# EAGLE design Model5 (EAGLE 6.5.0)
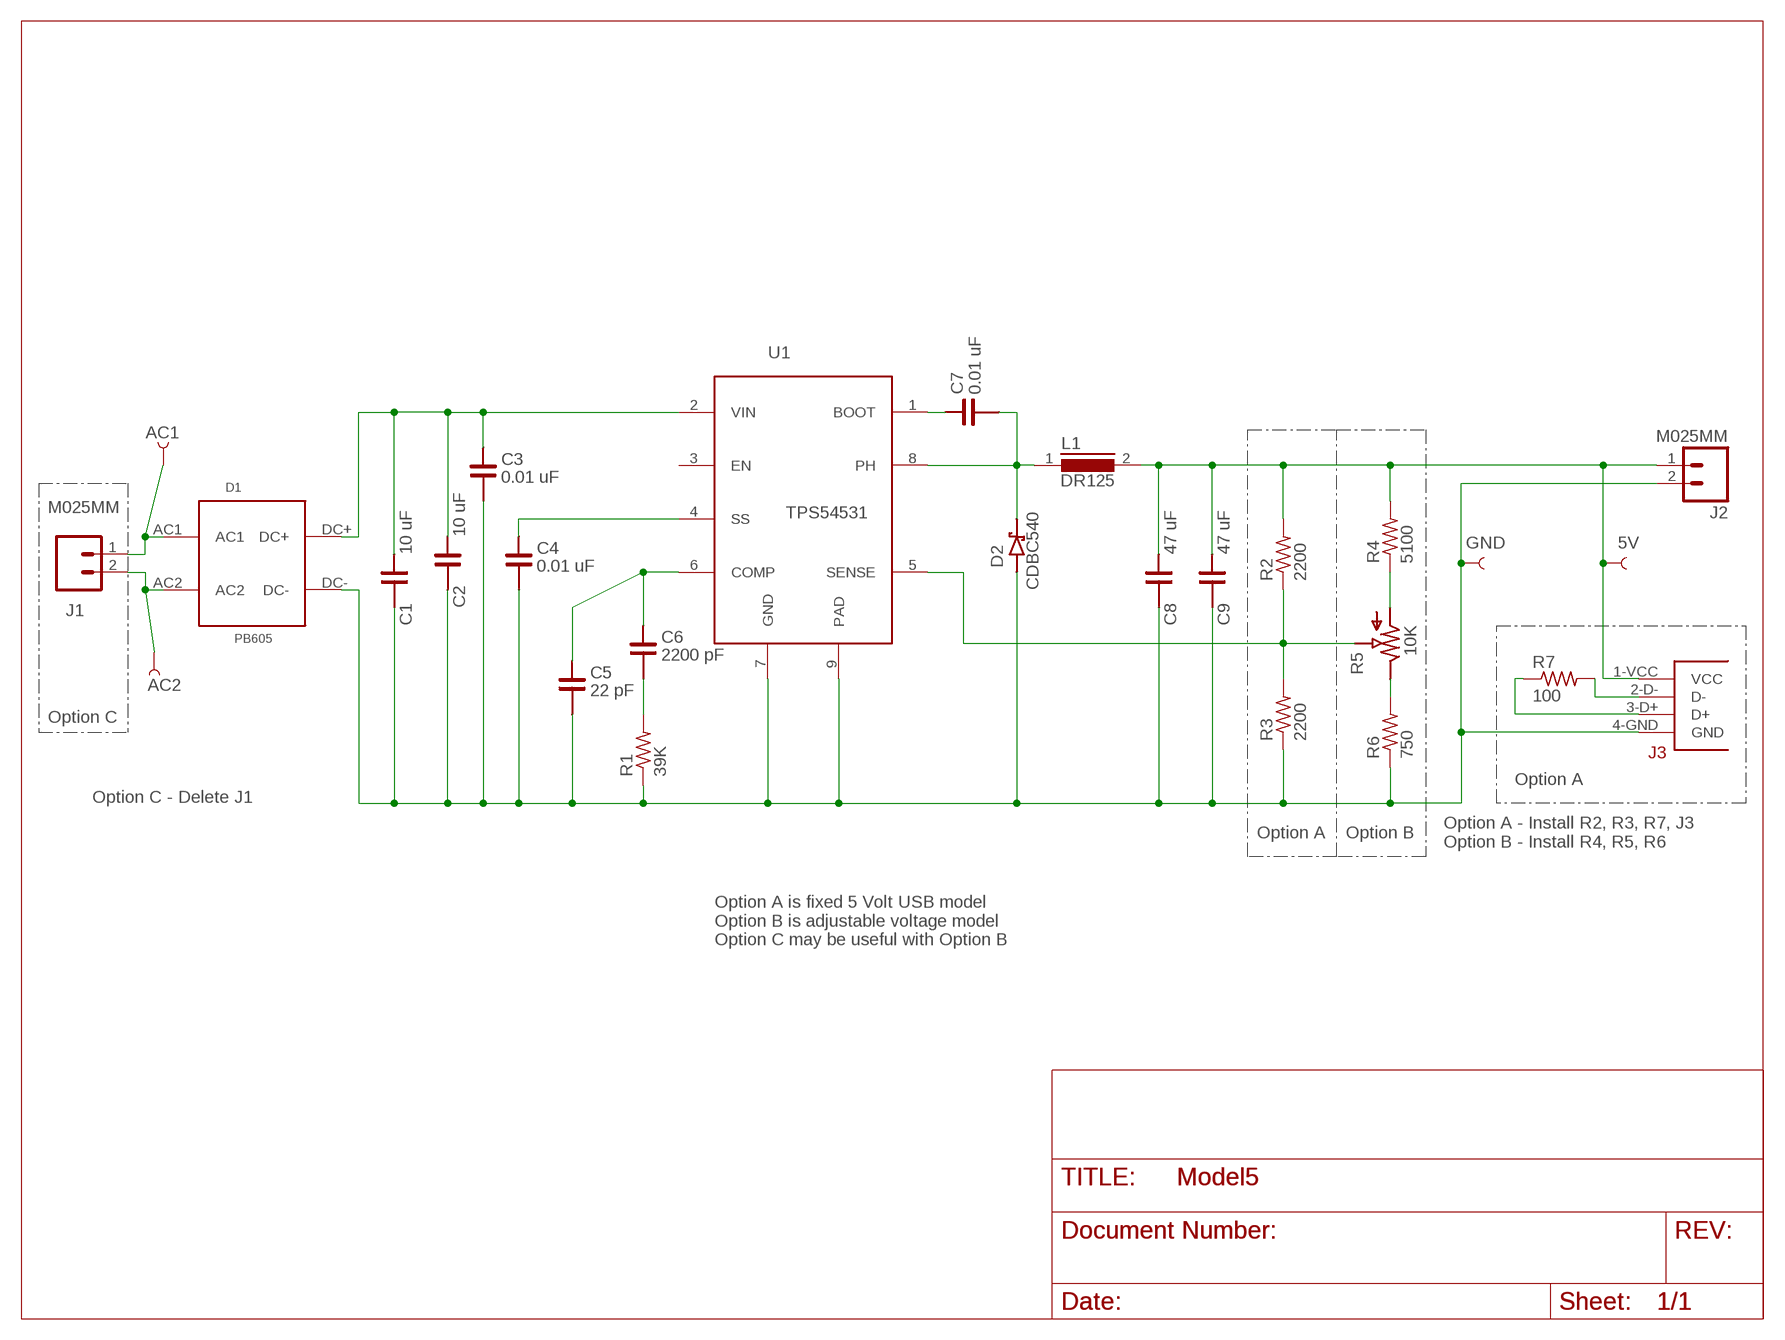
[diagram p0: schematic, sheet 1]

## Parts
5V  TEST-POINT3  [PAD.03X.03]
AC1  TEST-POINT3  [PAD.03X.03]
AC2  TEST-POINT3  [PAD.03X.03]
C1  10 uF  CN-1210  [1210]
C2  10 uF  CN-1210  [1210]
C3  0.01 uF  CN-0805  [0805]
C4  0.01 uF  CN-0805  [0805]
C5  22 pF  CN-0805  [0805]
C6  2200 pF  CN-0805  [0805]
C7  0.01 uF  CN-0805  [0805]
C8  47 uF  CN-1206  [C1206]
C9  47 uF  CN-1206  [C1206]
D1  PB605  [QUAD4PIN]
D2  CDBC540  [DO214AB]
GND  TEST-POINT3  [PAD.03X.03]
J1  M025MM  [SCREWTERMINAL-5MM-2]
J2  M025MM  [SCREWTERMINAL-5MM-2]
JP3  87520-USB-A-FEMALE  [87520-USB-A-FEMALE]
L1  DR125  [DR125]
R1  39K  R-US_R0805  [R0805]
R2  2200  R-US_R0805  [R0805]
R3  2200  R-US_R0805  [R0805]
R4  5100  R-US_R0805  [R0805]
R5  3214J  [3214J]
R6  750  R-US_R0805  [R0805]
R7  100  R-US_R0805  [R0805]
U1  TPS54531  [SOIC127P600X170-9N]

## Nets
5V [power]: 5V.P$1 C8.1 C9.1 J2.1 JP3.1-VCC(VCC) L1.2 R2.2 R4.2
AC1 [power]: AC1.P$1 D1.AC1 J1.1
AC2 [power]: AC2.P$1 D1.AC2 J1.2
BOOT: C7.1 U1.1(BOOT)
COMP: C5.1 C6.1 U1.6(COMP)
D+: JP3.3-D+(D+) R7.1
D-: JP3.2-D-(D-) R7.2
GND [power]: C1.2 C2.2 C3.2 C4.2 C5.2 C8.2 C9.2 D1.DC- D2.ANODE GND.P$1 J2.2 JP3.4-GND(GND) R1.1 R3.1 R6.1 U1.7(GND) U1.9(PAD)
N$1: C6.2 R1.2
N$2: R4.1 R5.P$1
N$7: R5.P$3 R6.2
SENSE: R2.1 R3.2 R5.P$2 U1.5(SENSE)
SLOW: C4.1 U1.4(SS)
VIN [power]: C1.1 C2.1 C3.1 D1.DC+ U1.2(VIN)
VSW [power]: C7.2 D2.CATHODE L1.1 U1.8(PH)
Unconnected: U1.3(EN)

## Notes on the sheet
- Option C
- Option A
- Option C - Delete J1
- Option A | Option B
- Option A - Install R2, R3, R7, J3
  Option B - Install R4, R5, R6
- Option A is fixed 5 Volt USB model
  Option B is adjustable voltage model
  Option C may be useful with Option B

## Library data of the parts
5V AC1 AC2 GND = SparkFun-Passives:TEST-POINT: Bare copper test points for troubleshooting or ICT
C1 C2 = passives:CN-1210
C3-C7 = passives:CN-0805
C8 C9 = passives:CN-1206
D1 = semi:PB605
D2 = semi:CDBC540
J1 J2 = SparkFun-Connectors:M02: Standard 2-pin 0.1" header. Use with - straight break away headers ( PRT-00116) - right angle break away headers (PRT-00553) - swiss pins (PRT-00743) - machine pins (PRT-00117) - female headers (PRT-00115) Molex polarized connector foot print use with: PRT-08233 with associated crimp pins and housings. 2.54_SCREWTERM for use with PRT-10571. 3.5mm Screw Terminal footprints for PRT-08084 5mm Screw Terminal footprints for use with PRT-08433
JP3 = mech:87520-USB-A-FEMALE
L1 = inductors:DR125: High Power Density, High Efficiency, Shielded Inductors Source: coiltronics_dr_series.pdf
R1-R4 R6 R7 = resistor:R-US_: RESISTOR, American symbol
R5 = mech:3214J
U1 = semi:TPS54531

## Net classes
1 ground: width 0.813 mm, drill 0.61 mm, clearance 0.305 mm
2 power: width 0.813 mm, drill 0.61 mm, clearance 0.305 mm

## Board
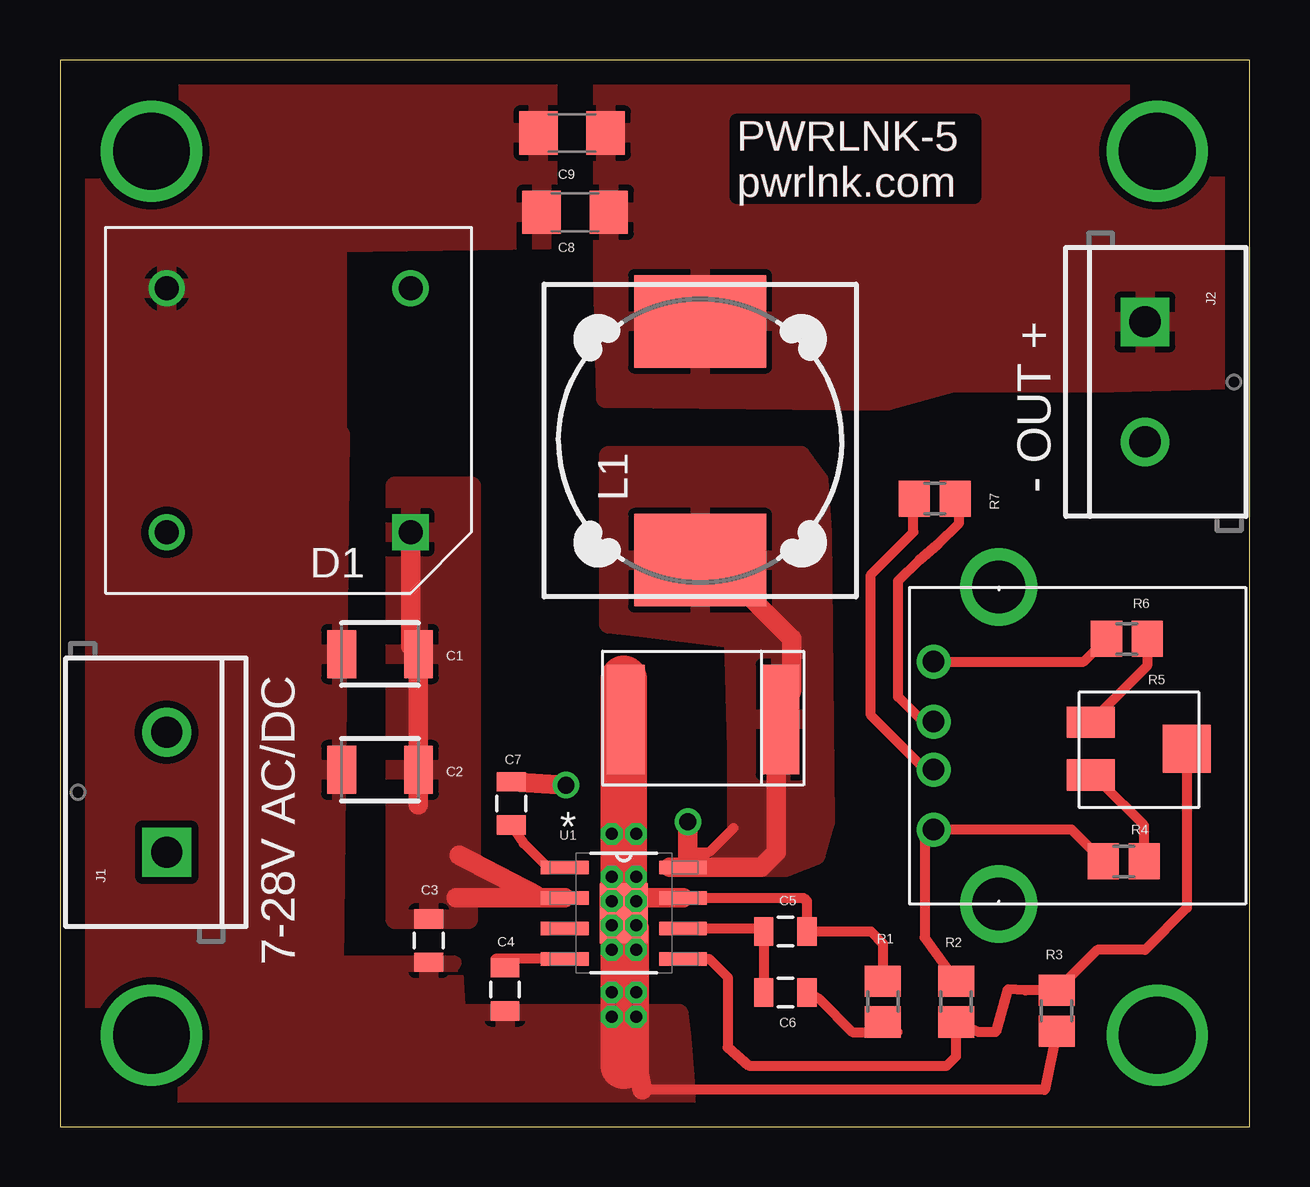
[diagram p1: board, top side]
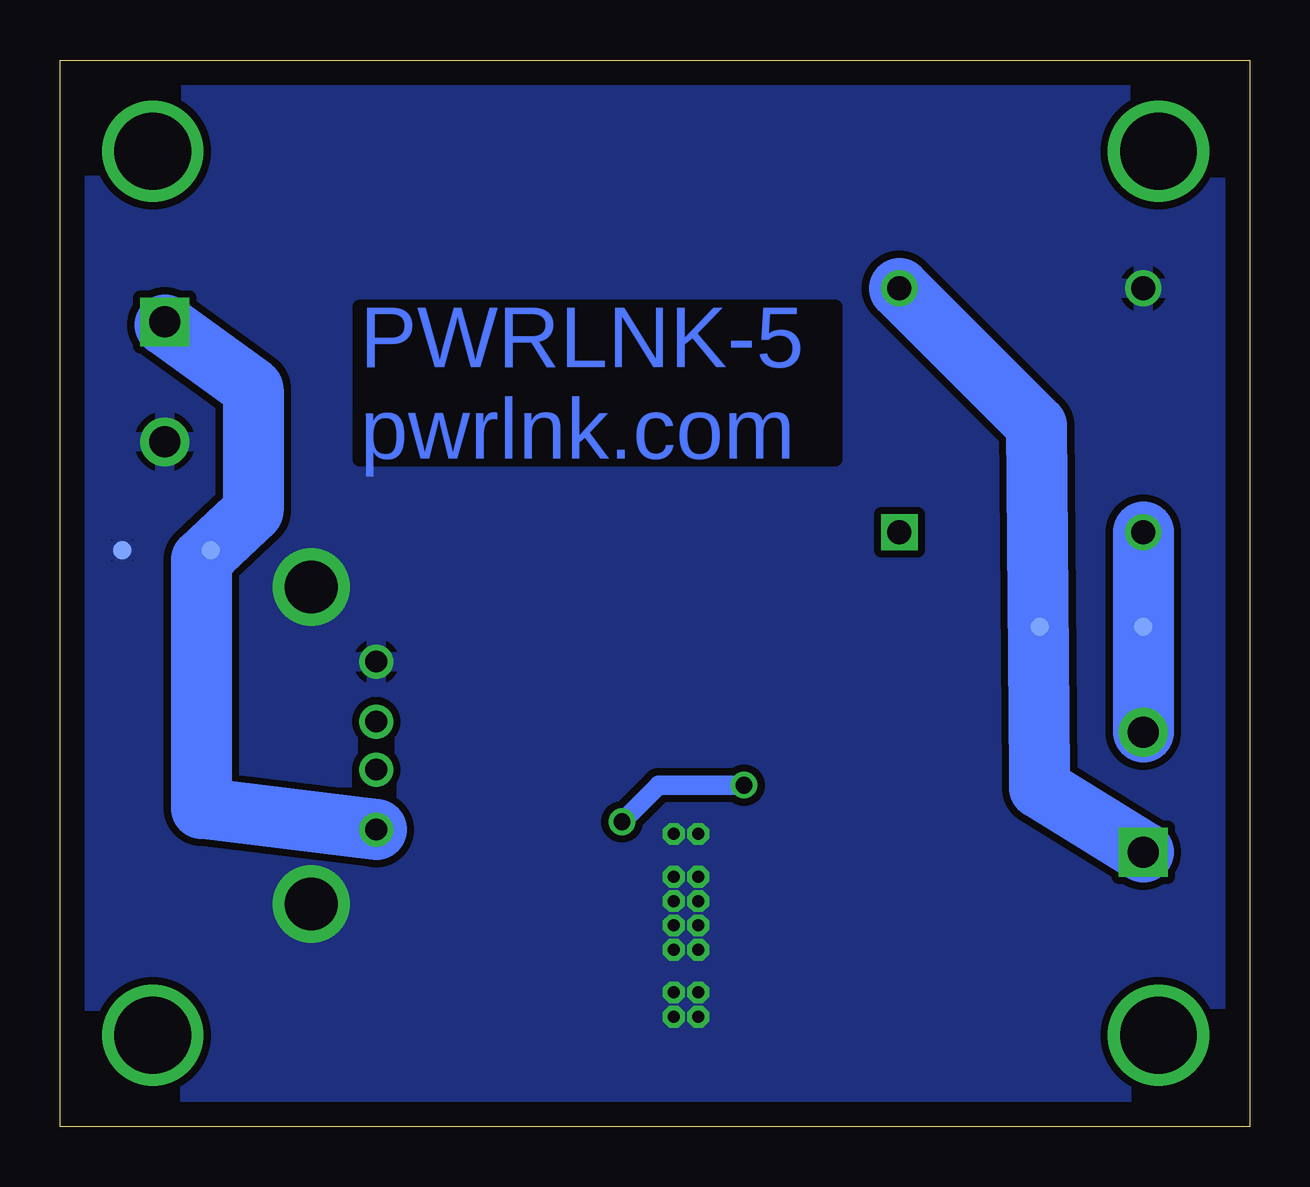
[diagram p2: board, bottom side, seen from below]

Size 49.58 x 44.44 mm. Coordinates in mm from the lower left corner, seen from the top.
Outline: 0,0 49.58,0 49.58,44.44 0,44.44 0,0
Copper layers (1*16): Top 0.035mm / dielectric 1.5mm / Bottom 0.035mm
Design rules "default *": minimum track width 10mil, minimum drill 18mil, track to track 8mil, track to pad 8mil, pad to pad 8mil, via to via 8mil, smd to smd 8mil, copper to edge 40mil, drill to drill 8mil, minimum pad ring 10mil, minimum via ring 8mil, stop-mask expansion 4mil, vias tented up to drill 0mil, thermal gap 10mil

### Footprints (pad centres in the part's own frame; a part is rotated, then mirrored left to right if it is on the bottom)
PAD.03X.03 = smd 0.762 x 0.762: P$1 0,0
1210 = smd 1.2 x 2: 1 -1.6,0; 2 1.6,0
0805 = smd 0.8 x 1.2: 1 -0.9,0; 2 0.9,0
C1206 = smd 1.6 x 1.8: 1 -1.4,0; 2 1.4,0
QUAD4PIN = drill 1: AC1 -12.7,2.54; AC2 -2.54,12.7; DC- -2.54,2.54 | drill 1 square: DC+ -12.7,12.7
DO214AB = smd 1.575 x 4.572: ANODE -3.1,-0.054; CATHODE 3.354,-0.054
SCREWTERMINAL-5MM-2 = drill 1.3 pad 2.032 square: 1 0,0 | drill 1.3 pad 2.032: 2 5,0
87520-USB-A-FEMALE = drill 0.9: 1-VCC 3.1,13; 2-D- 5.6,13; 3-D+ 7.6,13; 4-GND 10.1,13
DR125 = smd 3.85 x 5.5: 1 -4.975,0; 2 4.975,0
R0805 = smd 1.3 x 1.5: 1 -0.85,0; 2 0.85,0
3214J = smd 2 x 1.3: P$1 2,1.1; P$3 2,-1.1 | smd 2 x 2: P$2 -2,0
SOIC127P600X170-9N = smd 1.981 x 0.559: 1 -2.464,1.905; 2 -2.464,0.635; 3 -2.464,-0.635; 4 -2.464,-1.905; 5 2.464,-1.905; 6 2.464,-0.635; 7 2.464,0.635; 8 2.464,1.905 | smd 2.007 x 2.489: 9 0,0

### Placement (x,y rotation side)
5V  43.31,24 0 bottom
AC1  8.76,20.83 0 bottom
AC2  4.45,20.83 0 bottom
C1  13.34,19.68 180 top
C2  13.34,14.86 180 top
C3  15.37,7.75 270 top
C4  18.54,5.71 270 top
C5  30.23,8.13 0 top
C6  30.23,5.59 0 top
C7  18.8,13.46 90 top
C8  21.46,38.1 180 top
C9  21.34,41.4 180 top
D1  1.91,37.47 180 top
D2  26.67,17.02 0 top
GND  46.99,24 0 bottom
J1  4.45,11.43 90 top
J2  45.21,33.53 270 top
JP3  49.4,9.27 90 top
L1  26.67,28.57 90 top
R1  34.29,5.21 270 top
R2  37.34,5.21 90 top
R3  41.53,4.83 90 top
R4  44.32,11.05 180 top
R5  44.96,15.75 180 top
R6  44.45,20.32 0 top
R7  36.45,26.16 180 top
U1  23.5,8.89 0 top

### Tracks (layer width: path | path; a pad name or v marks a point on that pad's centre or on a via)
5V
  Top 0.406: R4.2 42.15,12.37 JP3.1-VCC 36.03,12 36.03,7.87 R2.2
  Bottom 0.406: 43.69,13.26 43.69,13.56 | 5V.P$1 43.3,23.99
  Bottom 0.813: J2.1 45.21,33.4
  Bottom 2.54: 45.21,33.4 41.53,30.73 41.53,25.65 43.3,23.99 43.69,23.62 43.69,13.56 | JP3.1-VCC 43.69,13.26
  pour Top: 22.61,43.94 48.9,43.81 48.9,37.34 48.77,31.11 43.81,30.99 37.21,30.99 34.42,30.23 22.73,30.35 22.61,35.43
AC1
  Bottom 0.406: AC1.P$1 8.76,14.74 8.77,14.73
  Bottom 2.54: D1.AC1 8.89,29.21 8.77,14.73 8.76,14.1 J1.1
AC2
  Bottom 2.54: D1.AC2 AC2.P$1 J1.2
BOOT
  Top 0.406: C7.1 19.32,11.8 20.32,10.79 U1.1
COMP
  Top 0.406: C6.1 C5.1 29.2,8.26 U1.6
D+
  Top 0.406: JP3.3-D+ 35.96,16.87 34.92,17.91 34.92,22.73 35.81,23.62 36.58,24.26 37.47,25.15 37.47,26 R7.1
D-
  Top 0.406: JP3.2-D- 36.06,14.87 33.78,17.14 33.78,22.99 35.56,24.77 35.56,26.12 R7.2
GND  (via drill 0.5, 2.2)
  Top 0.406: R3.1 41.02,1.52 24.26,1.52 | JP3.4-GND 42.65,19.37 R6.1 | U1.7 30.99,9.53 31.11,9.4 31.11,8.14 C5.2 33.78,8.13 34.29,7.62 R1.1
  Top 0.813: U1.7 23.11,9.53 U1.9 24.13,8.26 24.13,2.16 | 23.5,2.54 24.13,1.91 24.13,2.16 | D2.ANODE 23.5,17.78 | 24.26,1.52 24.13,2.16
  Top 1.93: 23.5,2.54 U1.9 23.5,17.78 23.5,18.67
  other vias: 39.12,22.48 39.12,9.27 22.99,10.41 24,10.41 22.99,9.4 24,9.4 22.99,8.38 24,8.38 24,7.37 22.99,7.37 24,5.59 22.99,5.59 24,12.19 22.99,12.19 22.99,4.57 24,4.57
  pour Top: 0.38,43.81 20.32,43.94 20.32,36.96 11.56,36.83 11.56,28.7 11.68,28.83 11.43,6.73 16.38,6.73 16.51,4.7 25.78,4.7 25.91,3.68 26.16,0.51 0.64,0.64
  pour Bottom: 0.64,43.94 49.53,43.94 48.77,0.64 0.64,0.64
N$1
  Top 0.406: C6.2 31.63,5.32 33.02,3.94 34.89,3.94 R1.2
N$2
  Top 0.406: 43.72,14.1 43.37,14.35 | 43.37,14.35 R5.P$1 | R4.1 45.17,12.55 43.37,14.35
N$3  (via drill 3.2)
  other vias: 3.81,3.81
N$4  (via drill 3.2)
  other vias: 45.72,3.81
N$6  (via drill 3.2)
  other vias: 3.81,40.64
N$7
  Top 0.406: 43.72,17.14 R5.P$3 45.3,19.19 R6.2
N$8  (via drill 3.2)
  other vias: 45.72,40.64
SENSE
  Top 0.406: R5.P$2 46.96,9.11 45.21,7.37 43.22,7.37 R3.2 40.22,5.68 39.5,5.71 38.99,3.94 38.27,3.94 R2.1 37.34,2.92 36.96,2.54 28.7,2.54 27.81,3.3 27.81,6.22 27.05,6.99 U1.5
SLOW
  Top 0.406: U1.4 18.15,6.99 C4.1
VIN
  Top 0.813: D1.DC+ 14.61,20.02 C1.1 C2.1 14.94,13.4 | U1.2 16.51,9.53 | 19.81,9.65 16.64,11.3
  pour Top: 13.97,26.67 13.97,8.64 17.02,8.64 17.02,9.53 20.32,9.53 18.8,10.03 17.14,10.16 17.14,26.67
VSW  (via drill 0.7)
  Top 0.406: 28.07,12.45 27.05,11.43 26.42,11.43 26.16,11.18 26.16,11
  Top 0.813: L1.1 26.67,24.13 30.48,20.32 30.48,18.18 D2.CATHODE | U1.8 29.21,10.79 29.84,11.43 29.84,17.55 | 25.4,10.79 U1.8 | C7.2 v21.08,14.22 | v26.16,12.7 26.16,11 U1.8
  Bottom 0.813: v21.08,14.22 24.64,14.22 v26.16,12.7
  pour Top: 22.86,27.94 22.86,20.95 24,20.83 28.07,20.32 28.19,15.75 28.19,11.68 26.67,10.79 30.23,10.79 31.5,11.3 31.88,12.7 31.75,24.77 31.62,26.92 30.86,27.94

### Text on the board
Top: PWRLNK-5 / pwrlnk.com
Bottom: PWRLNK-5 / pwrlnk.com
tNames: PWRLNK-5 / pwrlnk.com | - OUT + | 7-28V AC/DC